# EAGLE board TINRS - Looper (EAGLE 7.7.0), part 1 of 2
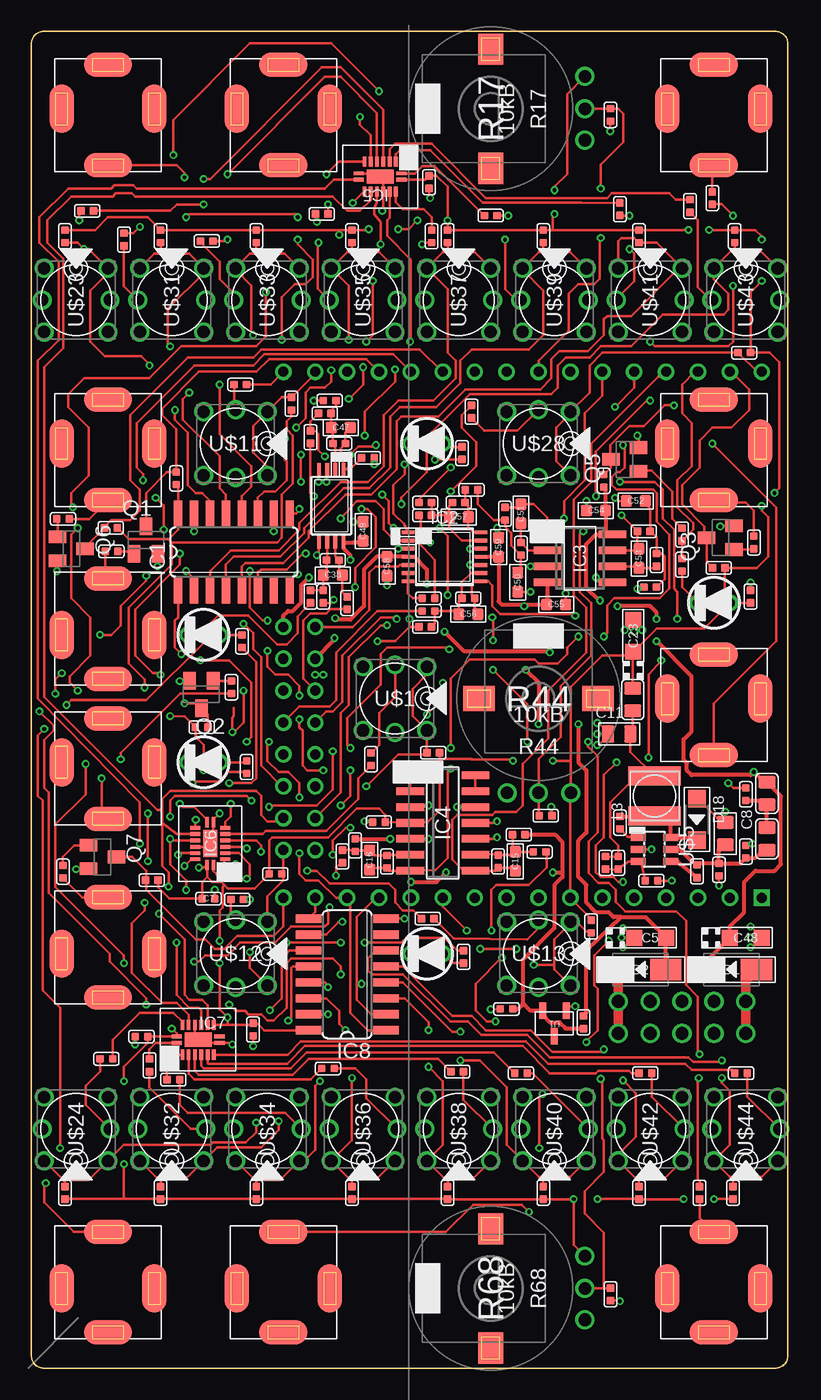
[diagram p7: board, top side]
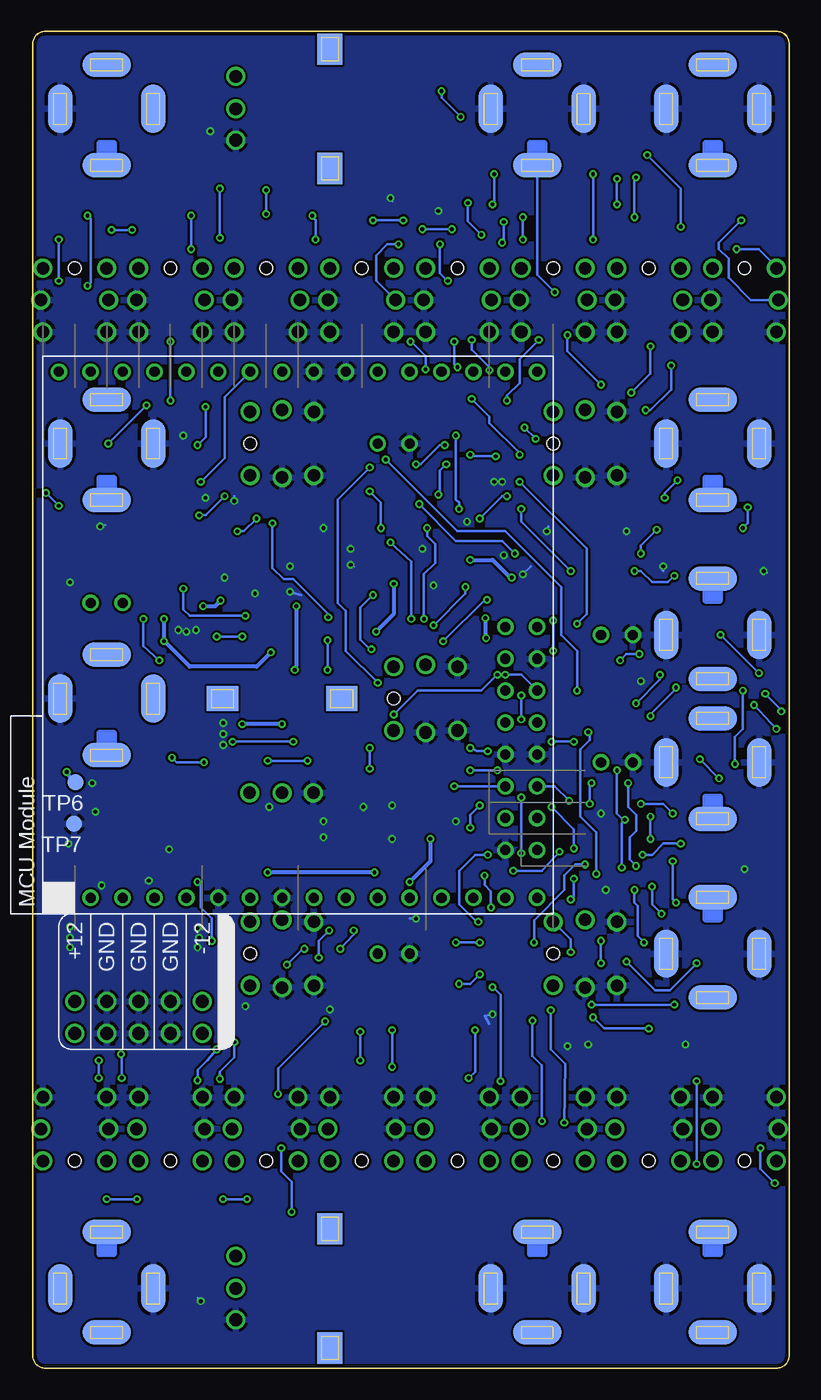
[diagram p8: board, bottom side, seen from below]

Size 60.25 x 106.5 mm. Coordinates in mm from the lower left corner, seen from the top.
Copper layers (1*16): Top 0.035mm / dielectric 1.5mm / Bottom 0.035mm
Design rules "dirt_cheap_dirty_boards.v1.1": minimum track width 6mil, minimum drill 12mil, track to track 6mil, track to pad 6mil, pad to pad 6mil, via to via 6mil, smd to smd 0mil, copper to edge 10mil, drill to drill 10mil, minimum pad ring 10mil, minimum via ring 6mil, stop-mask expansion 2mil, vias tented up to drill 25mil, thermal gap 10mil
Net classes: 0 default: width 0.203 mm, clearance 0.178 mm; 1 heavypower: width 0.305 mm; 2 mediumpower: width 0.254 mm; 3 groundplane: width 0.203 mm, clearance 0.203 mm; 4 returnground: width 0.356 mm; 5 reallyheav: width 0.762 mm

## Footprints (pad centres in the part's own frame; a part is rotated, then mirrored left to right if it is on the bottom)
C0402 = smd 0.6 x 0.6: 1 -0.5,0; 2 0.5,0
CASE-A_3216 = smd 1.27 x 1.27: + -1.27,0; - 1.27,0
C0805 = smd 1.016 x 1.397: 1 -0.889,0; 2 0.889,0
C0603 = smd 0.889 x 0.889: 1 -0.762,0; 2 0.762,0
DO-214AC = smd 2.5 x 1.7: 1 -2,0; 2 2,0
3MMLED = drill 0.8: + -1.27,0; - 1.27,0
SOD123 = smd 1.397 x 1.397: + -1.651,0; - 1.651,0
SO16 = smd 0.66 x 2.032: 1 -4.445,-3.073; 2 -3.175,-3.073; 3 -1.905,-3.073; 4 -0.635,-3.073; 5 0.635,-3.073; 6 1.905,-3.073; 7 3.175,-3.073; 8 4.445,-3.073; 9 4.445,3.073; 10 3.175,3.073; 11 1.905,3.073; 12 0.635,3.073; 13 -0.635,3.073; 14 -1.905,3.073; 15 -3.175,3.073; 16 -4.445,3.073
TSSOP14 = smd 0.305 x 0.991: 1 -1.95,-2.918; 2 -1.3,-2.918; 3 -0.65,-2.918; 4 0,-2.918; 5 0.65,-2.918; 6 1.3,-2.918; 7 1.95,-2.918; 8 1.95,2.918; 9 1.3,2.918; 10 0.65,2.918; 11 0,2.918; 12 -0.65,2.918; 13 -1.3,2.918; 14 -1.95,2.918
SO08 = smd 0.6 x 2.2: 1 -1.905,-2.6; 2 -0.635,-2.6; 3 0.635,-2.6; 4 1.905,-2.6; 5 1.905,2.6; 6 0.635,2.6; 7 -0.635,2.6; 8 -1.905,2.6
SO14 = smd 0.6 x 2.2: 1 -3.81,-2.6; 2 -2.54,-2.6; 3 -1.27,-2.6; 4 0,-2.6; 5 1.27,-2.6; 6 2.54,-2.6; 7 3.81,-2.6; 8 3.81,2.6; 9 2.54,2.6; 10 1.27,2.6; 11 0,2.6; 12 -1.27,2.6; 13 -2.54,2.6; 14 -3.81,2.6
QFN50P250X350X100-17N = smd 0.305 x 0.813: 1 -0.254,1.702; 8 -0.254,-1.702; 9 0.254,-1.702; 16 0.254,1.702 | smd 0.813 x 0.305: 2 -1.194,1.245; 3 -1.194,0.762; 4 -1.194,0.254; 5 -1.194,-0.254; 6 -1.194,-0.762; 7 -1.194,-1.245; 10 1.194,-1.245; 11 1.194,-0.762; 12 1.194,-0.254; 13 1.194,0.254; 14 1.194,0.762; 15 1.194,1.245 | smd 1.143 x 2.159: 17 0,0
POWER_10 = drill 1.016: 1 -5.08,-1.27; 2 -5.08,1.27; 3 -2.54,-1.27; 4 -2.54,1.27; 5 0,-1.27; 6 0,1.27; 7 2.54,-1.27; 8 2.54,1.27; 9 5.08,-1.27; 10 5.08,1.27
3.5MM-JACK-SWITCH-13MM-NOHOLES-TESTPAD = smd 1.95 x 3.85 bottom: RING_B@1 -3.7,0; SWITCH_B@1 3.7,0 | smd 1.95 x 3.85: RING_T@3 -3.7,0; SWITCH_T@3 3.7,0 | smd 3.85 x 1.95 bottom: SECOND_B@1 0,-3.5; TIP_B@1 0,4.5 | smd 3.85 x 1.95: SECOND_T@3 0,-3.5; TIP_T@3 0,4.5
L0805 = smd 1.016 x 1.397: 1 -0.889,0; 2 0.889,0
L0420 = smd 1.5 x 4.2: 1 -1.6,0; 2 1.6,0
SOT23-BEC = smd 1 x 1.4: B -0.95,-1.1; C 0,1.1; E 0.95,-1.1
R0402 = smd 0.6 x 0.6: 1 -0.5,0; 2 0.5,0
ALPS_POT_SQUAREHOLES = drill 1: P$1 -2.5,-7.5; P$2 0,-7.5; P$3 2.58,-7.5 | smd 2.5 x 2: P$4 -4.75,0; P$5 4.75,0 | smd 2.5 x 2 bottom: P$6 -4.75,0; P$7 4.75,0
B1,27 = smd 1.27 x 1.27: TP 0,0
SOT95P237X112-3N = smd 1.321 x 0.559: 1 -1.016,0.94; 2 -1.016,-0.94; 3 1.016,0
PB6149L = drill 1: 1 2.54,2.54; 2 2.54,-2.54; 3 -2.54,2.54; 4 -2.54,-2.54; LEDNEG 0,-2.7; LEDPOS 0,2.7 | hole 1: 2.54,0
SOT23-6 = smd 0.55 x 1.2: 1 -0.95,-1.3; 2 0,-1.3; 3 0.95,-1.3; 4 0.95,1.3; 5 0.003,1.3; 6 -0.95,1.3
TSSOP8 = smd 0.305 x 0.991: 1 -0.975,-2.918; 2 -0.325,-2.918; 3 0.325,-2.918; 4 0.975,-2.918; 5 0.975,2.918; 6 0.325,2.918; 7 -0.325,2.918; 8 -0.975,2.918
MCUPLUGIN = drill 0.8 square: P$1 -1.27,0 | drill 0.8: P$2 -1.27,-2.54; P$3 -1.27,-5.08; P$4 -1.27,-7.62; P$5 -1.27,-10.16; P$6 -1.27,-12.7; P$7 -1.27,-15.24; P$8 -1.27,-17.78; P$9 -1.27,-20.32; P$10 -1.27,-22.86; P$11 -1.27,-25.4; P$12 -1.27,-27.94; P$13 -1.27,-30.48; P$14 -1.27,-33.02; P$15 -1.27,-35.56; P$16 -1.27,-38.1; P$17 40.64,-38.1; P$18 40.64,-35.56; P$19 40.64,-33.02; P$20 40.64,-30.48; P$21 40.64,-27.94; P$22 40.64,-25.4; P$23 40.64,-22.86; P$24 40.64,-20.32; P$25 40.64,-17.78; P$26 40.64,-15.24; P$27 40.64,-12.7; P$28 40.64,-10.16; P$29 40.64,-7.62; P$30 40.64,-5.08; P$31 40.64,-2.54; P$32 40.64,0; P$33 2.54,-35.56; P$34 2.54,-38.1; P$35 5.08,-35.56; P$36 5.08,-38.1; P$37 7.62,-35.56; P$38 7.62,-38.1; P$39 10.16,-35.56; P$40 10.16,-38.1; P$41 12.7,-35.56; P$42 12.7,-38.1; P$43 15.24,-35.56; P$44 15.24,-38.1; P$45 17.78,-35.56; P$46 17.78,-38.1; P$47 20.32,-35.56; P$48 20.32,-38.1

## Placement (x,y rotation side)
C1  100nF  [C0402]  57.28,61.47 270 top
C2  100nF  [C0402]  8.77,26.42 0 top
C4  100nF  [C0402]  46.13,5.89 270 top
C5  10uF  [CASE-A_3216]  49.28,34.29 0 top
C6  100nF  [C0402]  37.84,28.62 0 top
C7  100nF  [C0402]  14.11,37.41 180 top
C8  10u  [C0805]  55.26,42.58 270 top
C11  22u  [C0805]  46.82,50.52 0 top
C14  100nF  [C0402]  31.67,94.48 90 top
C15  3.3nF  [C0603]  38.55,40.37 270 top
C16  3.3nF  [C0603]  26.94,40.48 270 top
C17  100nF  [C0402]  27.68,43.49 180 top
C20  100nF  [C0402]  17.66,26.97 90 top
C23  10uF  [CASE-A_3216]  47.93,58.34 90 top
C24  100nF  [C0402]  46.12,99.84 270 top
C38  100p  [C0603]  24.01,63.18 180 top
C41  100nF  [C0402]  40.96,44.02 0 top
C42  10n  [C0402]  56.9,45.72 270 top
C43  100nF  [C0402]  54.76,39.71 90 top
C44  100nF  [C0402]  56.9,41.15 270 top
C45  100nF  [C0402]  46.88,43.46 270 top
C46  33p  [C0402]  45.72,40.26 270 top
C47  100p  [C0603]  24.64,74.93 180 top
C48  10uF  [CASE-A_3216]  56.9,34.29 0 top
C49  100n  [C0603]  26.42,66.67 270 top
C50  470p  [C0603]  38.74,62.61 90 top
C51  47p  [C0603]  38.99,68.07 270 top
C52  470p  [C0603]  48.14,69.09 0 top
C53  47p  [C0603]  48.39,64.52 270 top
C54  100n  [C0603]  44.96,68.33 0 top
C55  100n  [C0603]  41.79,60.83 0 top
C56  47p  [C0603]  34.8,60.07 180 top
C57  47p  [C0603]  34.04,67.82 180 top
C58  100n  [C0603]  28.32,63.88 90 top
C59  100n  [C0603]  37.21,65.41 90 top
D1  MRA4004T3G  [DO-214AC]  55.76,31.75 180 top
D2  MRA4004T3G  [DO-214AC]  48.52,31.75 180 top
D3  yellow  [3MMLED]  54.36,60.96 180 top
D6  yellow  [3MMLED]  13.72,48.26 180 top
D7  yellow  [3MMLED]  31.5,73.66 180 top
D8  yellow  [3MMLED]  31.5,33.02 180 top
D9  yellow  [3MMLED]  13.72,58.42 180 top
D18  schottky  [SOD123]  53.01,43.71 270 top
IC1  74HC165D  [SO16]  16.13,65.02 0 top
IC2  TL074TSSOP14  [TSSOP14]  32.9,64.64 270 top
IC3  NE5532D  [SO08]  43.69,64.52 270 top
IC4  MCP6004  [SO14]  32.77,43.43 270 top
IC5  74HC595BQ  [QFN50P250X350X100-17N]  27.78,94.93 270 top
IC6  74HC595BQ  [QFN50P250X350X100-17N]  14.24,41.79 180 top
IC7  74HC595BQ  [QFN50P250X350X100-17N]  13.28,26.16 90 top
IC8  74HC165D  [SO16]  25.15,31.37 90 top
J14  POWER_SIMPLE10  [POWER_10]  51.82,27.94 180 bottom
JACK1  [3.5MM-JACK-SWITCH-13MM-NOHOLES-TESTPAD]  20.07,100.33 180 top
JACK2  [3.5MM-JACK-SWITCH-13MM-NOHOLES-TESTPAD]  20.07,6.35 0 top
JACK3  [3.5MM-JACK-SWITCH-13MM-NOHOLES-TESTPAD]  6.1,73.66 180 top
JACK4  [3.5MM-JACK-SWITCH-13MM-NOHOLES-TESTPAD]  6.1,58.42 0 top
JACK5  [3.5MM-JACK-SWITCH-13MM-NOHOLES-TESTPAD]  6.1,48.26 180 top
JACK6  [3.5MM-JACK-SWITCH-13MM-NOHOLES-TESTPAD]  6.1,33.02 0 top
JACK7  [3.5MM-JACK-SWITCH-13MM-NOHOLES-TESTPAD]  6.1,100.33 180 top
JACK8  [3.5MM-JACK-SWITCH-13MM-NOHOLES-TESTPAD]  6.1,6.35 0 top
JACK9  [3.5MM-JACK-SWITCH-13MM-NOHOLES-TESTPAD]  54.36,53.34 180 top
JACK10  [3.5MM-JACK-SWITCH-13MM-NOHOLES-TESTPAD]  54.36,100.33 180 top
JACK11  [3.5MM-JACK-SWITCH-13MM-NOHOLES-TESTPAD]  54.36,6.35 0 top
JACK12  [3.5MM-JACK-SWITCH-13MM-NOHOLES-TESTPAD]  54.36,73.66 180 top
L1  0.1uH C76737  [L0805]  58.58,45.79 270 top
L2  0.1uH C76737  [L0805]  58.58,42.17 270 top
L3  4.7uH  [L0420]  49.63,45.58 90 top
L4  0.1uH C76737  [L0805]  47.89,53.26 90 top
OUTLINE  EURORACK_PCB12HP  [EURORACK12HPPCB]  -0.25,0 0 top
Q1  MMBT3904  [SOT23-BEC]  9.14,65.97 0 top
Q2  MMBT3904  [SOT23-BEC]  13.53,53.68 180 top
Q3  MMBT3904  [SOT23-BEC]  54.87,66.17 90 top
Q5  MMBT3904  [SOT23-BEC]  47.25,72.39 90 top
Q6  MMBT3904  [SOT23-BEC]  3.18,65.28 270 top
Q7  MMBT3904  [SOT23-BEC]  5.66,40.73 270 top
R1  100k  [R0402]  2.52,67.66 180 top
R2  10k  [R0402]  6.33,66.96 0 top
R3  100k  [R0402]  2.52,39.55 90 top
R4  100k  [R0402]  57.54,65.79 270 top
R5  56  [R0402]  16.64,78.36 0 top
R6  10k  [R0402]  54.74,63.75 0 top
R7  56  [R0402]  16.39,37.34 0 top
R8  56  [R0402]  31.56,35.81 180 top
R9  56  [R0402]  4.45,92.2 0 top
R10  56  [R0402]  5.97,24.64 0 top
R11  10k  [R0402]  9.58,38.88 0 top
R12  33k  [R0402]  37.18,40.37 90 top
R13  10k  [R0402]  2.67,90.17 270 top
R14  100k  [R0402]  24.77,40.77 270 top
R15  100k  [R0402]  38.82,42.5 0 top
R16  100k  [R0402]  40.48,41.12 0 top
R17  10kB  [ALPS_POT_SQUAREHOLES]  36.58,100.33 90 top
R18  100k  [R0402]  6.38,65.07 0 top
R19  10k  [R0402]  2.67,13.97 90 top
R20  10k  [R0402]  11.54,70.89 270 top
R21  56  [R0402]  7.37,89.92 90 top
R22  33k  [R0402]  28.32,40.35 90 top
R23  100k  [R0402]  53.01,39.58 90 top
R24  56  [R0402]  9.4,24.13 90 top
R25  10k  [R0402]  10.29,90.17 270 top
R26  10k  [R0402]  43.96,27.56 270 top
R27  10k  [R0402]  10.29,13.97 90 top
R28  100k  [R0402]  25.79,41.66 90 top
R29  56  [R0402]  13.97,89.79 0 top
R30  56  [R0402]  35.06,76.2 90 top
R31  49.9k  [R0402]  46.74,40.26 270 top
R32  16.2k  [R0402]  49.38,38.83 0 top
R33  56  [R0402]  16.77,57.91 270 top
R34  56  [R0402]  34.42,32.77 90 top
R35  56  [R0402]  11.31,22.99 180 top
R36  10k  [R0402]  17.91,90.17 270 top
R37  10k  [R0402]  17.91,13.97 90 top
R38  56  [R0402]  23.12,91.95 0 top
R39  10k  [R0402]  45.58,70.69 270 top
R40  100k  [R0402]  51.82,66.42 90 top
R41  56  [R0402]  23.63,23.88 180 top
R42  10k  [R0402]  25.53,90.17 270 top
R43  10k  [R0402]  25.53,13.97 90 top
R44  10kB  [ALPS_POT_SQUAREHOLES]  40.39,53.34 0 top
R45  56  [R0402]  31.88,90.17 90 top
R46  56  [R0402]  33.91,23.62 180 top
R47  10k  [R0402]  33.15,90.17 270 top
R48  10k  [R0402]  33.15,13.97 90 top
R49  56  [R0402]  36.58,91.82 180 top
R50  56  [R0402]  38.99,23.5 180 top
R51  10k  [R0402]  40.77,90.17 270 top
R52  56  [R0402]  34.29,72.9 270 top
R53  10k  [R0402]  40.77,13.97 90 top
R54  56  [R0402]  46.87,92.33 90 top
R55  56  [R0402]  48.9,23.5 180 top
R56  10k  [R0402]  48.39,90.17 270 top
R57  10k  [R0402]  48.39,13.97 90 top
R58  56  [R0402]  52.46,92.58 90 top
R59  56  [R0402]  56.52,23.5 180 top
R60  10k  [R0402]  56.01,90.17 270 top
R61  10k  [R0402]  55.88,13.97 90 top
R62  100k  [R0402]  22.23,61.47 90 top
R63  100k  [R0402]  23.75,77.09 0 top
R64  12.1k  [R0402]  24.51,73.66 0 top
R65  12.1k  [R0402]  24.01,64.39 0 top
R66  4.42k  [R0402]  35.06,69.98 0 top
R67  100  [R0402]  26.8,72.52 0 top
R68  10kB  [ALPS_POT_SQUAREHOLES]  36.58,6.35 90 top
R69  100  [R0402]  25.15,60.96 270 top
R70  100k  [R0402]  31.63,61.34 0 top
R71  100k  [R0402]  22.23,74.17 90 top
R72  100k  [R0402]  15.93,54.25 90 top
R73  10k  [R0402]  13.55,51.06 180 top
R74  56  [R0402]  17.15,47.88 270 top
R75  12.1k  [R0402]  23.37,76.07 0 top
R76  12.1k  [R0402]  23.24,61.47 90 top
R77  4.02k  [R0402]  38.99,65.28 90 top
R78  35.7k  [R0402]  37.72,68.07 90 top
R79  56  [R0402]  53.22,13.97 270 top
R80  4.42k  [R0402]  49.28,62.23 0 top
R81  4.02k  [R0402]  49.79,64.39 270 top
R82  35.7k  [R0402]  48.77,66.67 180 top
R83  56  [R0402]  54.23,93.22 90 top
R84  100k  [R0402]  31.63,60.32 0 top
R85  100k  [R0402]  31.37,59.05 0 top
R86  100k  [R0402]  31.37,68.96 0 top
R87  100k  [R0402]  31.37,67.94 0 top
R88  100k  [R0402]  34.04,68.96 0 top
R89  100k  [R0402]  34.8,61.34 0 top
R90  56  [R0402]  27.05,48.51 270 top
R91  10k  [R0402]  44.58,35.18 270 top
R92  10k  [R0402]  56.77,80.9 180 top
R93  10k  [R0402]  19.43,39.37 0 top
R94  10k  [R0402]  20.71,76.83 90 top
R95  56  [R0402]  51.82,64.01 270 top
R96  10k  [R0402]  32.01,49.02 180 top
TP6  PTR1B1,27  [B1,27]  56.83,46.67 180 bottom
TP7  PTR1B1,27  [B1,27]  56.94,43.37 180 bottom
U1  LM4040DIM3-5.0  [SOT95P237X112-3N]  41.65,27.45 270 top
U$1  SWITCH_W_LED_PB6149L-X-102YELLOW  [PB6149L]  28.96,53.34 0 top
U$5  BL9342  [SOT23-6]  49.63,41.33 270 top
U$11  SWITCH_W_LED_PB6149L-X-102YELLOW  [PB6149L]  16.26,73.66 0 top
U$12  SWITCH_W_LED_PB6149L-X-102YELLOW  [PB6149L]  16.26,33.02 0 top
U$13  SWITCH_W_LED_PB6149L-X-102YELLOW  [PB6149L]  40.39,33.02 0 top
U$23  SWITCH_W_LED_PB6149L-X-102YELLOW  [PB6149L]  3.56,85.09 90 top
U$24  SWITCH_W_LED_PB6149L-X-102YELLOW  [PB6149L]  3.56,19.05 270 top
U$28  SWITCH_W_LED_PB6149L-X-102YELLOW  [PB6149L]  40.39,73.66 0 top
U$31  SWITCH_W_LED_PB6149L-X-102YELLOW  [PB6149L]  11.18,85.09 90 top
U$32  SWITCH_W_LED_PB6149L-X-102YELLOW  [PB6149L]  11.18,19.05 270 top
U$33  SWITCH_W_LED_PB6149L-X-102YELLOW  [PB6149L]  18.8,85.09 90 top
U$34  SWITCH_W_LED_PB6149L-X-102YELLOW  [PB6149L]  18.8,19.05 270 top
U$35  SWITCH_W_LED_PB6149L-X-102YELLOW  [PB6149L]  26.42,85.09 90 top
U$36  SWITCH_W_LED_PB6149L-X-102YELLOW  [PB6149L]  26.42,19.05 270 top
U$37  SWITCH_W_LED_PB6149L-X-102YELLOW  [PB6149L]  34.04,85.09 90 top
U$38  SWITCH_W_LED_PB6149L-X-102YELLOW  [PB6149L]  34.04,19.05 270 top
U$39  SWITCH_W_LED_PB6149L-X-102YELLOW  [PB6149L]  41.66,85.09 90 top
U$40  SWITCH_W_LED_PB6149L-X-102YELLOW  [PB6149L]  41.66,19.05 270 top
U$41  SWITCH_W_LED_PB6149L-X-102YELLOW  [PB6149L]  49.28,85.09 90 top
U$42  SWITCH_W_LED_PB6149L-X-102YELLOW  [PB6149L]  49.28,19.05 270 top
U$43  SWITCH_W_LED_PB6149L-X-102YELLOW  [PB6149L]  56.9,85.09 90 top
U$44  SWITCH_W_LED_PB6149L-X-102YELLOW  [PB6149L]  56.9,19.05 270 top
U$50  MCP6022I/ST  [TSSOP8]  23.88,68.71 180 top
U$55  MCUPLUGIN2  [MCUPLUGIN]  58.17,38.73 90 bottom